# Altium schematic sheet main.SchDoc
size D
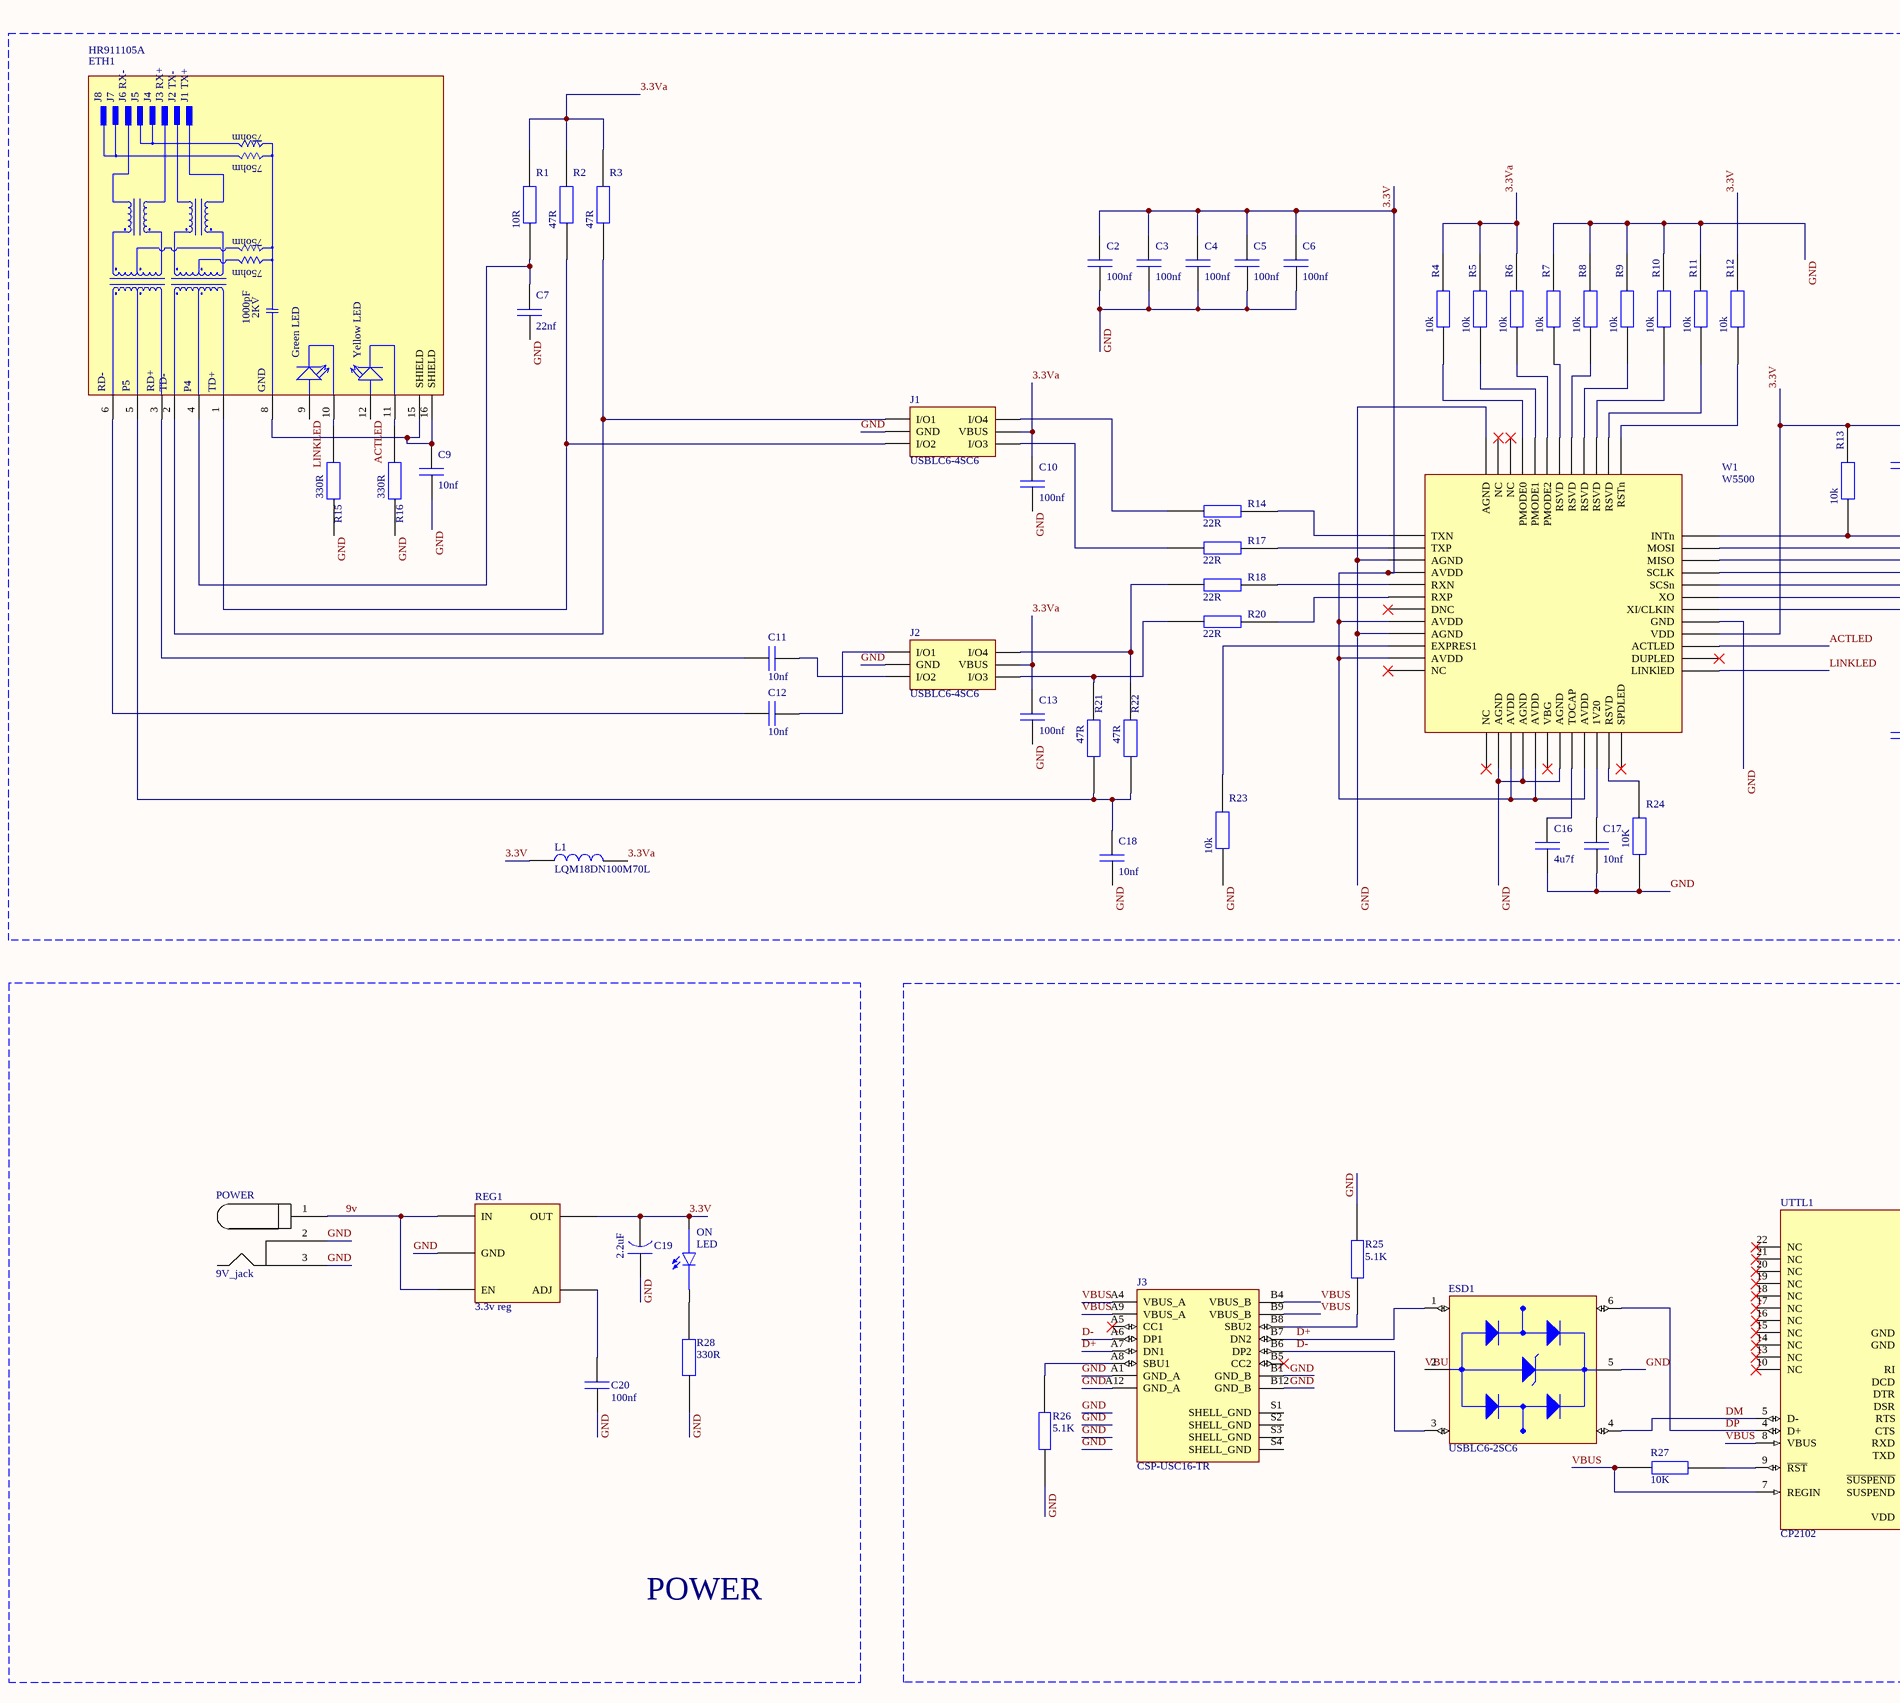
[diagram p0: main.SchDoc, left]
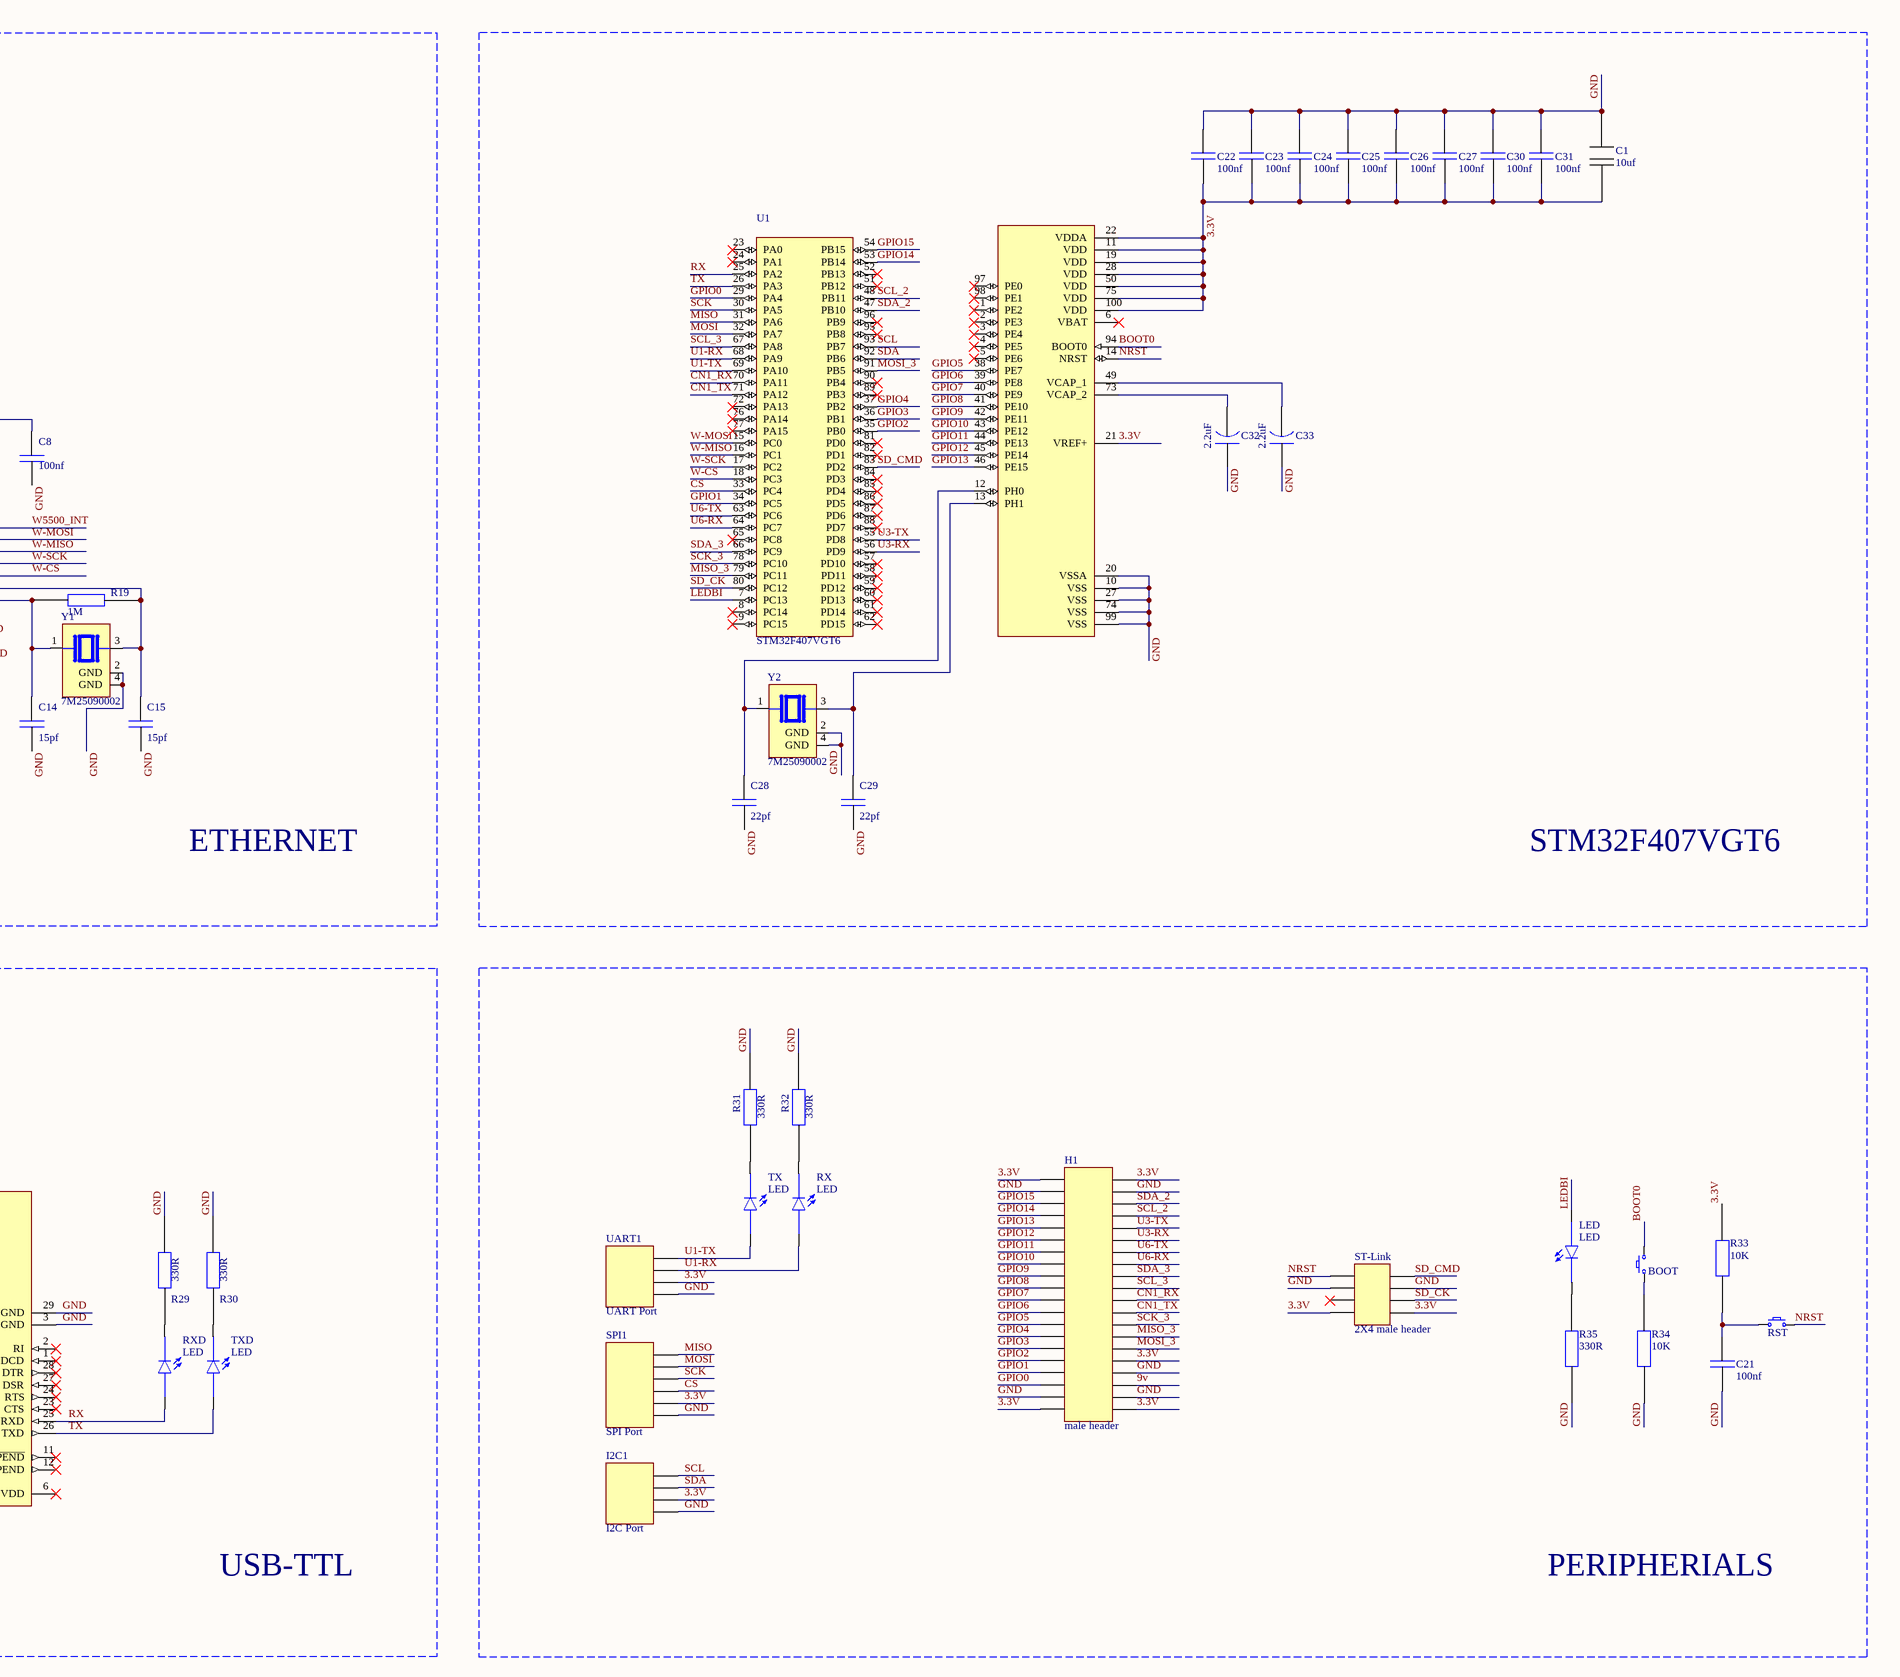
[diagram p1: main.SchDoc, right]

## Parts
BOOT  Button_SMD_1  [Button_SMD_1]  (value not drawn)
C1  10uf  [TANTAL_CAP]
C2  100nf  [0603 CAP]
C3  100nf  [0603 CAP]
C4  100nf  [0603 CAP]
C5  100nf  [0603 CAP]
C6  100nf  [0603 CAP]
C7  22nf  [0603 CAP]
C8  100nf  [0603 CAP]
C9  10nf  [0603 CAP]
C10  100nf  [0603 CAP]
C11  10nf  [0603 CAP]
C12  10nf  [0603 CAP]
C13  100nf  [0603 CAP]
C14  15pf  [0603 CAP]
C15  15pf  [0603 CAP]
C16  4u7f  [0603 CAP]
C17  10nf  [0603 CAP]
C18  10nf  [0603 CAP]
C19  2.2uF  [2.2uF TAN CAP]
C20  100nf  [0603 CAP]
C21  100nf  [0603 CAP]
C22  100nf  [0603 CAP]
C23  100nf  [0603 CAP]
C24  100nf  [0603 CAP]
C25  100nf  [0603 CAP]
C26  100nf  [0603 CAP]
C27  100nf  [0603 CAP]
C28  22pf  [0603 CAP]
C29  22pf  [0603 CAP]
C30  100nf  [0603 CAP]
C31  100nf  [0603 CAP]
C32  2.2uF  [2.2uF TAN CAP]
C33  2.2uF  [2.2uF TAN CAP]
ESD1  USBLC6-2SC6  [SOT95P280X145-6N]
ETH1  HR911105A  [HANRUN_HR911105A]
H1  male header  [2x20 Male Header]
I2C1  I2C Port  [JST_4P_SMD_FLAT]
J1  USBLC6-4SC6  [SOT23-6L]
J2  USBLC6-4SC6  [SOT23-6L]
J3  CSP-USC16-TR  [VALCON_CSP-USC16-TR]
L1  LQM18DN100M70L  [INDC1608X95N]
LED  LED  [LEDSC160X80X70L45N]
ON  LED  [LEDSC160X80X70L45N]
POWER  9V_jack  [9V_JACK]
R1  10R  [0603 RES]
R2  47R  [0603 RES]
R3  47R  [0603 RES]
R4  10k  [0603 RES]
R5  10k  [0603 RES]
R6  10k  [0603 RES]
R7  10k  [0603 RES]
R8  10k  [0603 RES]
R9  10k  [0603 RES]
R10  10k  [0603 RES]
R11  10k  [0603 RES]
R12  10k  [0603 RES]
R13  10k  [0603 RES]
R14  22R  [0603 RES]
R15  330R  [0603 RES]
R16  330R  [0603 RES]
R17  22R  [0603 RES]
R18  22R  [0603 RES]
R19  1M  [0603 RES]
R20  22R  [0603 RES]
R21  47R  [0603 RES]
R22  47R  [0603 RES]
R23  10k  [0603 RES]
R24  10K  [0603 RES]
R25  5.1K  [0603 RES]
R26  5.1K  [0603 RES]
R27  10K  [0603 RES]
R28  330R  [0603 RES]
R29  330R  [0603 RES]
R30  330R  [0603 RES]
R31  330R  [0603 RES]
R32  330R  [0603 RES]
R33  10K  [0603 RES]
R34  10K  [0603 RES]
R35  330R  [0603 RES]
REG1  3.3v reg  [3.3v reg]
RST  Button_SMD_1  [Button_SMD_1]  (value not drawn)
RX  LED  [LEDSC160X80X70L45N]
RXD  LED  [LEDSC160X80X70L45N]
SPI1  SPI Port  [JST_6P_SMD_FLAT]
ST-Link  2X4 male header  [2X4 male header - duplicate]
TX  LED  [LEDSC160X80X70L45N]
TXD  LED  [LEDSC160X80X70L45N]
U1  STM32F407VGT6  [QFP50P1600X1600X160-100N]
UART1  UART Port  [JST_4P_SMD_FLAT]
UTTL1  CP2102  [QFN50P500X500X100-29N]
W1  W5500  [W5500]
Y1  7M25090002  [XTAL_7M25090002]
Y2  7M25090002  [XTAL_7M25090002]

## Blocks framed on the sheet
ETHERNET: C2-C18 ETH1 J1 J2 L1 R1-R24 W1 Y1
STM32F407VGT6: C1 C22-C33 U1 Y2
POWER: C19 C20 ON POWER R28 REG1
USB-TTL: ESD1 J3 R25-R27 R29 R30 RXD TXD UTTL1
PERIPHERIALS: BOOT C21 H1 I2C1 LED R31-R35 RST RX SPI1 ST-Link TX UART1

## Nets
3.3V: C1.2 C2.2 C3.2 C4.2 C5.2 C6.2 C8.2 C19.2 C22.2 C23.2 C24.2 C25.2 C26.2 C27.2 C30.2 C31.2 H1.1 H1.20 H1.21 H1.25 H1.40 I2C1.2 L1.1 ON.A R12.2 R13.2 R33.2 REG1.5(OUT) SPI1.2 ST-Link.4 ST-Link.5 U1.11(VDD) U1.19(VDD) U1.21(VREF+) U1.22(VDDA) U1.28(VDD) U1.50(VDD) U1.75(VDD) U1.100(VDD) UART1.2 W1.4(AVDD) W1.15(AVDD) W1.8(AVDD) W1.11(AVDD) W1.17(AVDD) W1.21(AVDD) W1.28(VDD)
3.3Va: C10.2 C13.2 J1.5(VBUS) J2.5(VBUS) L1.2 R1.2 R2.2 R3.2 R4.2 R5.2 R6.2
9v: H1.23 POWER.1 REG1.1(IN) REG1.3(EN)
ACTLED: ETH1.12(YA) W1.27(ACTLED)
BOOT0: BOOT.2 U1.94(BOOT0)
CN1_RX: H1.30 U1.70(PA11)
CN1_TX: H1.29 U1.71(PA12)
CS: SPI1.3 U1.33(PC4)
D+: ESD1.1(I/O1_IN) J3.A7(DN1) J3.B7(DN2)
D-: ESD1.3(I/O2_IN) J3.A6(DP1) J3.B6(DP2)
DM: ESD1.4(I/O2_OUT) UTTL1.5(D-)
DP: ESD1.6(I/O1_OUT) UTTL1.4(D+)
GND: C1.1 C2.1 C3.1 C4.1 C5.1 C6.1 C7.1 C8.1 C9.1 C10.1 C13.1 C14.1 C15.1 C16.1 C17.1 C18.1 C19.1 C20.1 C21.1 C22.1 C23.1 C24.1 C25.1 C26.1 C27.1 C28.1 C29.1 C30.1 C31.1 C32.1 C33.1 ESD1.5(VBUS) H1.2 H1.19 H1.22 H1.24 H1.39 I2C1.1 J1.2(GND) J2.2(GND) J3.A1(GND_A) J3.A12(GND_A) J3.B1(GND_B) J3.B12(GND_B) POWER.2 POWER.3 R7.2 R8.2 R9.2 R10.2 R11.2 R15.1 R16.1 R23.1 R24.1 R25.2 R26.1 R28.2 R29.2 R30.2 R31.2 R32.2 R34.1 R35.2 REG1.2(GND) SPI1.1 ST-Link.2 ST-Link.7 U1.10(VSS) U1.20(VSSA) U1.27(VSS) U1.74(VSS) U1.99(VSS) UART1.1 UTTL1.3(GND) UTTL1.29(GND) W1.3(AGND) W1.9(AGND) W1.14(AGND) W1.16(AGND) W1.19(AGND) W1.29(GND) W1.48(AGND) Y1.2(GND) Y1.4(GND) Y2.2(GND) Y2.4(GND)
GPIO0: H1.18 U1.29(PA4)
GPIO1: H1.17 U1.34(PC5)
GPIO2: H1.16 U1.35(PB0)
GPIO3: H1.15 U1.36(PB1)
GPIO4: H1.14 U1.37(PB2)
GPIO5: H1.13 U1.38(PE7)
GPIO6: H1.12 U1.39(PE8)
GPIO7: H1.11 U1.40(PE9)
GPIO8: H1.10 U1.41(PE10)
GPIO9: H1.9 U1.42(PE11)
GPIO10: H1.8 U1.43(PE12)
GPIO11: H1.7 U1.44(PE13)
GPIO12: H1.6 U1.45(PE14)
GPIO13: H1.5 U1.46(PE15)
GPIO14: H1.4 U1.53(PB14)
GPIO15: H1.3 U1.54(PB15)
LEDBI: LED.A U1.7(PC13)
LINKLED: ETH1.9(GA) W1.25(LINKlED)
MISO: SPI1.6 U1.31(PA6)
MISO_3: H1.27 U1.79(PC11)
MOSI: SPI1.5 U1.32(PA7)
MOSI_3: H1.26 U1.91(PB5)
NRST: RST.2 ST-Link.1 U1.14(NRST)
RX: RXD.A U1.25(PA2) UTTL1.25(RXD)
SCK: SPI1.4 U1.30(PA5)
SCK_3: H1.28 U1.78(PC10)
SCL: I2C1.4 U1.93(PB7)
SCL_2: H1.37 U1.48(PB11)
SCL_3: H1.31 U1.67(PA8)
SD_CK: ST-Link.6 U1.80(PC12)
SD_CMD: ST-Link.8 U1.83(PD2)
SDA: I2C1.3 U1.92(PB6)
SDA_2: H1.38 U1.47(PB10)
SDA_3: H1.32 U1.66(PC9)
TX: TXD.A U1.26(PA3) UTTL1.26(TXD)
U1-RX: RX.A U1.68(PA9) UART1.3
U1-TX: TX.A U1.69(PA10) UART1.4
U3-RX: H1.35 U1.56(PD9)
U3-TX: H1.36 U1.55(PD8)
U6-RX: H1.33 U1.64(PC7)
U6-TX: H1.34 U1.63(PC6)
VBUS: ESD1.2(GND) J3.A4(VBUS_A) J3.A9(VBUS_A) J3.B4(VBUS_B) J3.B9(VBUS_B) R27.1 UTTL1.7(REGIN) UTTL1.8(VBUS)
W5500_INT: R13.1 W1.36(INTn)
W-CS: U1.18(PC3) W1.32(SCSn)
W-MISO: U1.16(PC1) W1.34(MISO)
W-MOSI: U1.15(PC0) W1.35(MOSI)
W-SCK: U1.17(PC2) W1.33(SCLK)
NetBOOT_1: BOOT.1 R34.2
NetC7_2: C7.2 ETH1.4(P4) R1.1
NetC9_2: C9.2 ETH1.8(GND) ETH1.15(SHIELD) ETH1.16(SHIELD)
NetC11_1: C11.1 ETH1.3(RD+)
NetC11_2: C11.2 J2.3(I/O2)
NetC12_1: C12.1 ETH1.6(RD-)
NetC12_2: C12.2 J2.1(I/O1)
NetC14_2: C14.2 R19.1 W1.30(XI/CLKIN) Y1.1
NetC15_2: C15.2 R19.2 W1.31(XO) Y1.3
NetC16_2: C16.2 W1.20(TOCAP)
NetC17_2: C17.2 W1.22(1V20)
NetC18_2: C18.2 ETH1.5(P5) R21.1 R22.1
NetC20_2: C20.2 REG1.4(ADJ)
NetC21_2: C21.2 R33.1 RST.1
NetC28_2: C28.2 U1.12(PH0) Y2.1
NetC29_2: C29.2 U1.13(PH1) Y2.3
NetC32_2: C32.2 U1.73(VCAP_2)
NetC33_2: C33.2 U1.49(VCAP_1)
NetETH1_1: ETH1.1(TD+) J1.3(I/O2) R2.1
NetETH1_2: ETH1.2(TD-) J1.1(I/O1) R3.1
NetETH1_10: ETH1.10(GC) R15.2
NetETH1_11: ETH1.11(YC) R16.2
NetJ1_4: J1.4(I/O3) R17.1
NetJ1_6: J1.6(I/O4) R14.1
NetJ2_4: J2.4(I/O3) R20.1 R21.2
NetJ2_6: J2.6(I/O4) R18.1 R22.2
NetJ3_A8: J3.A8(SBU1) R26.2
NetJ3_B8: J3.B8(SBU2) R25.1
NetLED_C: LED.C R35.1
NetON_C: ON.C R28.1
NetR4_1: R4.1 W1.45(PMODE0)
NetR5_1: R5.1 W1.44(PMODE1)
NetR6_1: R6.1 W1.43(PMODE2)
NetR7_1: R7.1 W1.42(RSVD)
NetR8_1: R8.1 W1.41(RSVD)
NetR9_1: R9.1 W1.40(RSVD)
NetR10_1: R10.1 W1.39(RSVD)
NetR11_1: R11.1 W1.38(RSVD)
NetR12_1: R12.1 W1.37(RSTn)
NetR14_2: R14.2 W1.1(TXN)
NetR17_2: R17.2 W1.2(TXP)
NetR18_2: R18.2 W1.5(RXN)
NetR20_2: R20.2 W1.6(RXP)
NetR23_2: R23.2 W1.10(EXPRES1)
NetR24_2: R24.2 W1.23(RSVD)
NetR27_2: R27.2 UTTL1.9(~{RST})
NetR29_1: R29.1 RXD.C
NetR30_1: R30.1 TXD.C
NetR31_1: R31.1 TX.C
NetR32_1: R32.1 RX.C

Not connected (* = marked no-connect by the designer): J3 A5(CC1)* B5(CC2)* S1(SHELL_GND) S2(SHELL_GND) S3(SHELL_GND) S4(SHELL_GND); ST-Link 3*; U1 1(PE2)* 2(PE3)* 3(PE4)* 4(PE5)* 5(PE6)* 6(VBAT)* 8(PC14)* 9(PC15)* 23(PA0)* 24(PA1)* 51(PB12)* 52(PB13)* 57(PD10)* 58(PD11)* 59(PD12)* 60(PD13)* 61(PD14)* 62(PD15)* 65(PC8)* 72(PA13)* 76(PA14)* 77(PA15)* 81(PD0)* 82(PD1)* 84(PD3)* 85(PD4)* 86(PD5)* 87(PD6)* 88(PD7)* 89(PB3)* 90(PB4)* 95(PB8)* 96(PB9)* 97(PE0)* 98(PE1)*; UTTL1 1(DCD)* 2(RI)* 6(VDD)* 10(NC)* 11(~{SUSPEND})* 12(SUSPEND)* 13(NC)* 14(NC)* 15(NC)* 16(NC)* 17(NC)* 18(NC)* 19(NC)* 20(NC)* 21(NC)* 22(NC)* 23(CTS)* 24(RTS)* 27(DSR)* 28(DTR)*; W1 12 (NC)* 13(NC)*  7(DNC)*  18(VBG)*  24(SPDLED)*  26(DUPLED)*  46(NC)*  47(NC)*

## Notes on the sheet
- (in symbol HR911105A) J8; J7; J6 RX-; J5; J4; J3 RX+; J2 TX-; J1 TX+; 75ohm; 2KV; 1000pF; Green LED; Yellow LED

## Library data of the parts
C1 = tan_cap
C2-C18 C20-C31 = 0603 CAP
C19 C32 C33 = 2.2uF TAN CAP
ESD1 = USBLC6-2SC6: 17V Clamp 5A (8/20Âµs) Ipp Tvs Diode Surface Mount SOT-23-6; MF: STMicroelectronics; Value: *; SnapEDA_Link: https://www.snapeda.com/parts/USBLC6-2SC6/STMicroelectronics/view-part/?ref=snap; Check_prices: https://www.snapeda.com/parts/USBLC6-2SC6/STMicroelectronics/view-part/?ref=eda; Purchase-URL: https://pricing.snapeda.com/search/part/USBLC6-2SC6/?ref=eda; Price: None; Availability: In Stock; Package: SOT-23-6 STMicroelectronics; MP: USBLC6-2SC6
ETH1 = HR911105A: DIP RJ45 Connector;; MF: hanrun; SnapEDA_Link: https://www.snapeda.com/parts/HR911105A/HanRun/view-part/?ref=snap; Package: None; MP: HR911105A; Check_prices: https://www.snapeda.com/parts/HR911105A/HanRun/view-part/?ref=eda; Price: None; Value: *; Availability: Not in stock
H1 = 2x20 male header
I2C1 UART1 = JST_4P_SMD_FLAT
J1 J2 = USBLC6-4SC6: 17V Clamp 5A (8/20µs) Ipp Tvs Diode Surface Mount SOT-23-6; MF: STMicroelectronics; SnapEDA_Link: https://www.snapeda.com/parts/USBLC6-4SC6/STMicroelectronics/view-part/?ref=snap; Package: SOT-23-6 STMicroelectronics; Value: *; MP: USBLC6-4SC6; Check_prices: https://www.snapeda.com/parts/USBLC6-4SC6/STMicroelectronics/view-part/?ref=eda
J3 = CSP-USC16-TR: CSP-USC16-TR Valcon USB Type C Surface Mount PCB Socket; SnapEDA_Link: https://www.snapeda.com/parts/CSP-USC16-TR/Valcon/view-part/?ref=snap; MF: Valcon; MP: CSP-USC16-TR; Availability: In Stock; Price: None; Value: *; Check_prices: https://www.snapeda.com/parts/CSP-USC16-TR/Valcon/view-part/?ref=eda; Package: None; Purchase-URL: https://pricing.snapeda.com/search/part/CSP-USC16-TR/?ref=eda
L1 = LQM18DN100M70L: Inductor with Inductance 10uH Tol.+/-20% Package 0603 (1608); MF: Murata Electronics; MP: LQM18DN100M70L; Price: None; SnapEDA_Link: https://www.snapeda.com/parts/LQM18DN100M70L/Murata/view-part/4834755/?ref=snap; Package: 0603 Murata; Availability: Unavailable; Value: *
LED ON RX RXD TX TXD = LED: Red 626nm LED Indication - Discrete 1.9V 0603 _1608 Metric_; MP: 597-5004-407F; MF: Dialight; Price: None; Availability: Unavailable; Package: 0603 Dialight; Value: *; SnapEDA_Link: https://www.snapeda.com/parts/597-5004-407F/Dialight/view-part/429800/?ref=snap
R1-R35 = 0603 RES
SPI1 = JST_6P_SMD_FLAT
ST-Link = 2X4 male header: 2.54 pitch 2X4 male header
U1 = STM32F407VGT6: STM32 Series 32-bit 1 MB Flash 192 kB RAM ARM Based Microcontroller - LQFP-100; Price: None; Value: *; MP: STM32F407VGT6; Package: None; Availability: Unavailable
UTTL1 = CP2102: CP2102N USB 2.0 to UART (RS232) Bridge Interface Evaluation Board; MF: Silicon Labs; Purchase-URL: https://pricing.snapeda.com/search/part/CP2102/?ref=eda; Package: WFQFN-20 Silicon Labs; Value: *; Check_prices: https://www.snapeda.com/parts/CP2102/Silicon+Labs/view-part/?ref=eda; SnapEDA_Link: https://www.snapeda.com/parts/CP2102/Silicon+Labs/view-part/?ref=snap; Availability: In Stock; Price: None; MP: CP2102
Y1 Y2 = 7M25090002: 25 MHz Â±10ppm Crystal 18pF 4-SMD, No Lead; MF: TXC; Availability: In Stock; Check_prices: https://www.snapeda.com/parts/7M25090002/TXC/view-part/?ref=eda; Price: None; SnapEDA_Link: https://www.snapeda.com/parts/7M25090002/TXC/view-part/?ref=snap; MP: 7M25090002; Value: *; Purchase-URL: https://pricing.snapeda.com/search/part/7M25090002/?ref=eda; Package: SMD-4 TXC